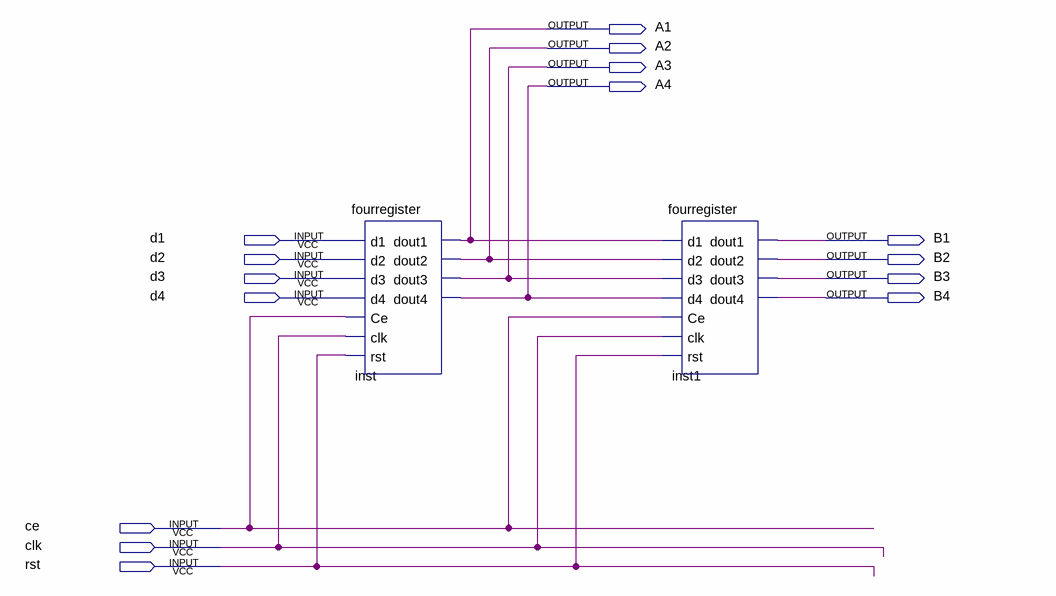
[diagram p0: schematic sheet]
// Quartus schematic work5.bdf as structural Verilog: 2 symbols, 15 pins
module work5 (
  input  d1,
  input  d2,
  input  d3,
  input  d4,
  input  ce,
  input  clk,
  input  rst,
  output A1,
  output A2,
  output A3,
  output A4,
  output B1,
  output B2,
  output B3,
  output B4
);

  fourregister inst (
    .d1(d1), .d2(d2), .d3(d3), .d4(d4), .Ce(ce), .clk(clk), .rst(rst), .dout1(A1), .dout2(A2), .dout3(A3),
    .dout4(A4));
  fourregister inst1 (
    .d1(A1), .d2(A2), .d3(A3), .d4(A4), .Ce(ce), .clk(clk), .rst(rst), .dout1(B1), .dout2(B2), .dout3(B3),
    .dout4(B4));
endmodule
